# Altium schematic sheet main_Sheet1.SchDoc
size 594 x 420 mm; SheetNumber: 1; SheetTotal: 1; ListNumber: 1; Обозначение: ИУ4.11.03.03.25.08.05.1 Э3; Наименование1: Автоматизированный; Наименование2: подводный дрон; Тип документа: Схема электрическая принципиальная
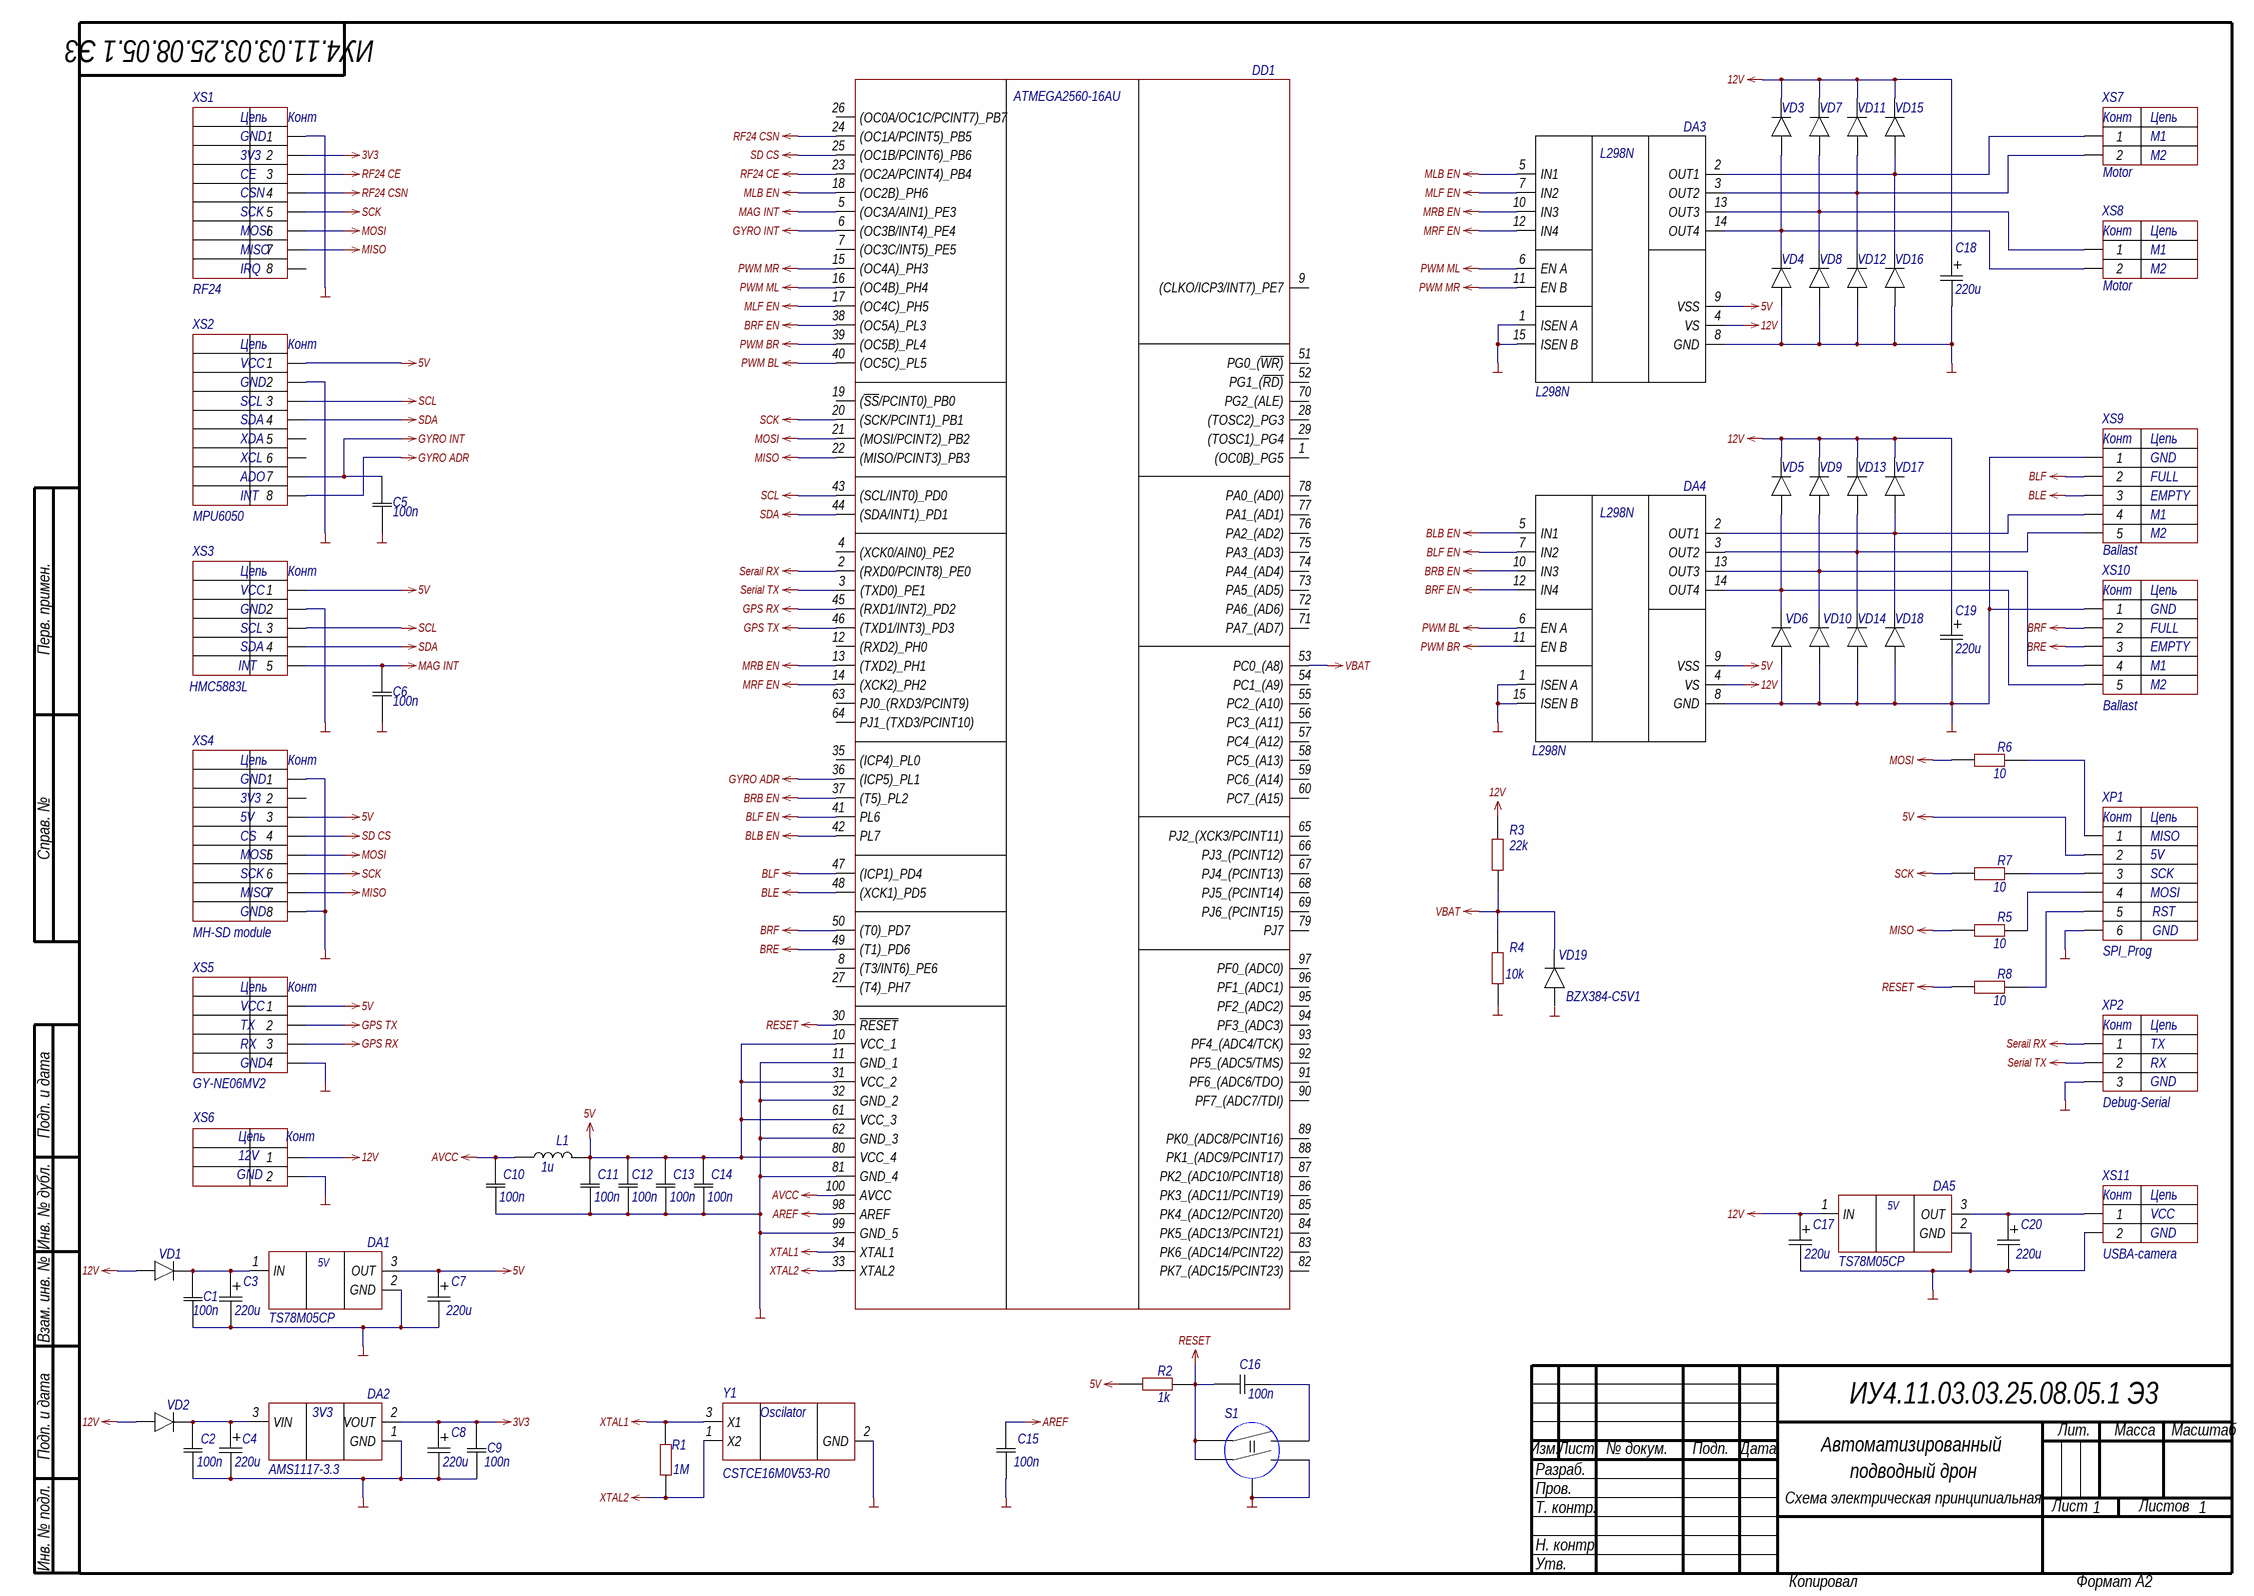
[diagram p0: main_Sheet1.SchDoc]

## Parts
C1  100n  [CAPC3216X95N]
C2  100n  [CAPC3216X95N]
C3  220u  [CAPAE830X1050N]
C4  220u  [CAPAE830X1050N]
C5  100n  [CAPC3216X95N]
C6  100n  [CAPC3216X95N]
C7  220u  [CAPAE830X1050N]
C8  220u  [CAPAE830X1050N]
C9  100n  [CAPC3216X95N]
C10  100n  [CAPC3216X95N]
C11  100n  [CAPC3216X95N]
C12  100n  [CAPC3216X95N]
C13  100n  [CAPC3216X95N]
C14  100n  [CAPC3216X95N]
C15  100n  [CAPC3216X95N]
C16  100n  [CAPC3216X95N]
C17  220u  [CAPAE830X1050N]
C18  220u  [CAPAE830X1050N]
C19  220u  [CAPAE830X1050N]
C20  220u  [CAPAE830X1050N]
DA1  TS78M05CP  [TS78M05CP]
DA2  AMS1117-3.3  [SOT229P700X180-4N]
DA3  L298N  [TO127P500X2020X2210-15P]
DA4  L298N  [TO127P500X2020X2210-15P]
DA5  TS78M05CP  [TS78M05CP]
DD1  ATMEGA2560-16AU  [QFP50P1600X1600X120-100N]  (value not drawn)
L1  1u  [INDPM3225X240N]
R1  1M  [RESC3126X65N]
R2  1k  [RESC3126X65N]
R3  22k  [RESC3126X65N]
R4  10k  [RESC3126X65N]
R5  10  [RESC3126X65N]
R6  10  [RESC3126X65N]
R7  10  [RESC3126X65N]
R8  10  [RESC3126X65N]
S1  FSM1LPASTR  [FSM1LPASTR]  (value not drawn)
VD1  (no value)  [1N4007W]
VD2  1N4007W  [1N4007W]  (value not drawn)
VD3  1N4007W  [1N4007W]  (value not drawn)
VD4  1N4007W  [1N4007W]  (value not drawn)
VD5  1N4007W  [1N4007W]  (value not drawn)
VD6  1N4007W  [1N4007W]  (value not drawn)
VD7  1N4007W  [1N4007W]  (value not drawn)
VD8  1N4007W  [1N4007W]  (value not drawn)
VD9  1N4007W  [1N4007W]  (value not drawn)
VD10  1N4007W  [1N4007W]  (value not drawn)
VD11  1N4007W  [1N4007W]  (value not drawn)
VD12  1N4007W  [1N4007W]  (value not drawn)
VD13  1N4007W  [1N4007W]  (value not drawn)
VD14  1N4007W  [1N4007W]  (value not drawn)
VD15  1N4007W  [1N4007W]  (value not drawn)
VD16  1N4007W  [1N4007W]  (value not drawn)
VD17  1N4007W  [1N4007W]  (value not drawn)
VD18  1N4007W  [1N4007W]  (value not drawn)
VD19  BZX384-C5V1  [SOD2512X110N]
XP1  SPI_Prog  [PLS_2x3]
XP2  Debug-Serial  [PLS_1x3]
XS1  RF24  [nRF24]
XS2  MPU6050  [MPU6050]
XS3  HMC5883L  [HMC5883L]
XS4  MH-SD module  [SD-module]
XS5  GY-NE06MV2  [GY-GPS]
XS6  XT60PW-M  [XT60PWM]  (value not drawn)
XS7  Motor  [S2B-XH-A-1]
XS8  Motor  [S2B-XH-A-1]
XS9  Ballast  [S5B-XH-A-1]
XS10  Ballast  [S5B-XH-A-1]
XS11  USBA-camera  [TYPE-C-SMD]
Y1  CSTCE16M0V53-R0  [CSTCE16M0V53R0]

## Nets
3V3: C8.1(+) C9.1 DA2.2(VOUT) XS1.2
5V: C7.1(+) C11.1 C12.1 C13.1 C14.1 DA1.3(OUT) DA3.9(VSS) DA4.9(VSS) DD1.10(VCC_1) DD1.31(VCC_2) DD1.61(VCC_3) DD1.80(VCC_4) L1.2 R2.1 XP1.2 XS2.1 XS3.1 XS4.3 XS5.1
12V: C17.1(+) C18.1(+) C19.1(+) DA3.4(VS) DA4.4(VS) DA5.1(IN) R3.2 VD1.2(A) VD2.2(A) VD3.1(K) VD5.1(K) VD7.1(K) VD9.1(K) VD11.1(K) VD13.1(K) VD15.1(K) VD17.1(K) XS6.1
AREF: C15.1 DD1.98(AREF)
AVCC: C10.1 DD1.100(AVCC) L1.1
BLB EN: DA4.5(IN1) DD1.42(PL7)
BLE: DD1.48((XCK1)_PD5) XS9.3
BLF: DD1.47((ICP1)_PD4) XS9.2
BLF EN: DA4.7(IN2) DD1.41(PL6)
BRB EN: DA4.10(IN3) DD1.37((T5)_PL2)
BRE: DD1.49((T1)_PD6) XS10.3
BRF: DD1.50((T0)_PD7) XS10.2
BRF EN: DA4.12(IN4) DD1.38((OC5A)_PL3)
GND: C1.2 C2.2 C3.2(-) C4.2(-) C5.2 C6.2 C7.2(-) C8.2(-) C9.2 C10.2 C11.2 C12.2 C13.2 C14.2 C15.2 C17.2(-) C18.2(-) C19.2(-) C20.2(-) DA1.2(GND) DA2.1(GND) DA3.1(ISEN_A) DA3.8(GND) DA3.15(ISEN_B) DA4.1(ISEN_A) DA4.8(GND) DA4.15(ISEN_B) DA5.2(GND) DD1.11(GND_1) DD1.32(GND_2) DD1.62(GND_3) DD1.81(GND_4) DD1.99(GND_5) R4.1 S1.4(NO_2) S1.5(GND) VD4.2(A) VD6.2(A) VD8.2(A) VD10.2(A) VD12.2(A) VD14.2(A) VD16.2(A) VD18.2(A) XP1.6 XP2.3 XS1.1 XS2.2 XS3.2 XS4.1 XS4.8 XS5.4 XS6.2 XS9.1 XS10.1 XS11.4(2) Y1.2(GND)
GPS RX: DD1.45((RXD1/INT2)_PD2) XS5.3
GPS TX: DD1.46((TXD1/INT3)_PD3) XS5.2
GYRO ADR: DD1.36((ICP5)_PL1) XS2.8
GYRO INT: C5.1 DD1.6((OC3B/INT4)_PE4) XS2.7
MAG INT: C6.1 DD1.5((OC3A/AIN1)_PE3) XS3.5
MISO: DD1.22((MISO/PCINT3)_PB3) R5.1 XS1.7 XS4.7
MLB EN: DA3.5(IN1) DD1.18((OC2B)_PH6)
MLF EN: DA3.7(IN2) DD1.17((OC4C)_PH5)
MOSI: DD1.21((MOSI/PCINT2)_PB2) R6.1 XS1.6 XS4.5
MRB EN: DA3.10(IN3) DD1.13((TXD2)_PH1)
MRF EN: DA3.12(IN4) DD1.14((XCK2)_PH2)
PWM BL: DA4.6(EN_A) DD1.40((OC5C)_PL5)
PWM BR: DA4.11(EN_B) DD1.39((OC5B)_PL4)
PWM ML: DA3.6(EN_A) DD1.16((OC4B)_PH4)
PWM MR: DA3.11(EN_B) DD1.15((OC4A)_PH3)
RESET: C16.1 DD1.30(~{RESET}) R2.2 R8.1 S1.1(COM_1) S1.2(COM_2)
RF24 CE: DD1.23((OC2A/PCINT4)_PB4) XS1.3
RF24 CSN: DD1.24((OC1A/PCINT5)_PB5) XS1.4
SCK: DD1.20((SCK/PCINT1)_PB1) R7.1 XS1.5 XS4.6
SCL: DD1.43((SCL/INT0)_PD0) XS2.3 XS3.3
SD CS: DD1.25((OC1B/PCINT6)_PB6) XS4.4
SDA: DD1.44((SDA/INT1)_PD1) XS2.4 XS3.4
Serail RX: DD1.2((RXD0/PCINT8)_PE0) XP2.1
Serial TX: DD1.3((TXD0)_PE1) XP2.2
VBAT: DD1.53(PC0_(A8)) R3.1 R4.2 VD19.1(K)
XTAL1: DD1.34(XTAL1) R1.2 Y1.3(X1)
XTAL2: DD1.33(XTAL2) R1.1 Y1.1(X2)
NetC1_1: C1.1 C3.1(+) DA1.1(IN) VD1.1(K)
NetC2_1: C2.1 C4.1(+) DA2.3(VIN) VD2.1(K)
NetC16_2: C16.2 S1.3(NO_1)
NetC20_1: C20.1(+) DA5.3(OUT) XS11.1
NetDA3_2: DA3.2(OUT1) VD15.2(A) VD16.1(K) XS7.1
NetDA3_3: DA3.3(OUT2) VD11.2(A) VD12.1(K) XS7.2
NetDA3_13: DA3.13(OUT3) VD7.2(A) VD8.1(K) XS8.1
NetDA3_14: DA3.14(OUT4) VD3.2(A) VD4.1(K) XS8.2
NetDA4_2: DA4.2(OUT1) VD17.2(A) VD18.1(K) XS9.4
NetDA4_3: DA4.3(OUT2) VD13.2(A) VD14.1(K) XS9.5
NetDA4_13: DA4.13(OUT3) VD9.2(A) VD10.1(K) XS10.4
NetDA4_14: DA4.14(OUT4) VD5.2(A) VD6.1(K) XS10.5
NetR5_2: R5.2 XP1.4
NetR6_2: R6.2 XP1.1
NetR7_2: R7.2 XP1.3
NetR8_2: R8.2 XP1.5

Not connected (* = marked no-connect by the designer): DD1 1((OC0B)_PG5) 4((XCK0/AIN0)_PE2) 7((OC3C/INT5)_PE5) 8((T3/INT6)_PE6) 9((CLKO/ICP3/INT7)_PE7) 12((RXD2)_PH0) 19((~{SS}/PCINT0)_PB0) 26((OC0A/OC1C/PCINT7)_PB7) 27((T4)_PH7) 28((TOSC2)_PG3) 29((TOSC1)_PG4) 35((ICP4)_PL0) 51(PG0_(~{WR)}) 52(PG1_(~{RD)}) 54(PC1_(A9)) 55(PC2_(A10)) 56(PC3_(A11)) 57(PC4_(A12)) 58(PC5_(A13)) 59(PC6_(A14)) 60(PC7_(A15)) 63(PJ0_(RXD3/PCINT9)) 64(PJ1_(TXD3/PCINT10)) 65(PJ2_(XCK3/PCINT11)) 66(PJ3_(PCINT12)) 67(PJ4_(PCINT13)) 68(PJ5_(PCINT14)) 69(PJ6_(PCINT15)) 70(PG2_(ALE)) 71(PA7_(AD7)) 72(PA6_(AD6)) 73(PA5_(AD5)) 74(PA4_(AD4)) 75(PA3_(AD3)) 76(PA2_(AD2)) 77(PA1_(AD1)) 78(PA0_(AD0)) 79(PJ7) 82(PK7_(ADC15/PCINT23)) 83(PK6_(ADC14/PCINT22)) 84(PK5_(ADC13/PCINT21)) 85(PK4_(ADC12/PCINT20)) 86(PK3_(ADC11/PCINT19)) 87(PK2_(ADC10/PCINT18)) 88(PK1_(ADC9/PCINT17)) 89(PK0_(ADC8/PCINT16)) 90(PF7_(ADC7/TDI)) 91(PF6_(ADC6/TDO)) 92(PF5_(ADC5/TMS)) 93(PF4_(ADC4/TCK)) 94(PF3_(ADC3)) 95(PF2_(ADC2)) 96(PF1_(ADC1)) 97(PF0_(ADC0)); VD19 2(A); XS1 8; XS2 5 6; XS4 2

## Notes on the sheet
- Labels drawn without touching a wire or pin: GND
- Перв. примен.
- Справ. №
- Подп. и дата
- Инв. № дубл.
- Взам. инв. №
- Разраб.
- Изм.
- Лист
- № докум.
- Подп.
- Дата
- Лит.
- Масса
- Масштаб
- Пров.
- Т. контр.
- Листов
- Инв. № подл.
- Н. контр.
- Утв.
- Копировал
- Формат А2
- (in symbol AMS1117-3.3) 3V3
- (in symbol Ballast) Конт; Цепь; GND; FULL; EMPTY; M1; M2
- (in symbol CSTCE16M0V53-R0) Oscilator
- (in symbol Debug-Serial) Конт; Цепь; TX; RX; GND
- (in symbol GY-NE06MV2) Цепь; Конт; VCC; TX; RX; GND
- (in symbol HMC5883L) Цепь; Конт; VCC; GND; SCL; SDA; INT
- (in symbol MH-SD module) Цепь; Конт; GND; 3V3; 5V; CS; MOSI; SCK; MISO
- (in symbol Motor) Конт; Цепь; M1; M2
- (in symbol MPU6050) Цепь; Конт; VCC; GND; SCL; SDA; XDA; XCL; ADO; INT
- (in symbol nRF24) Цепь; Конт; GND; 3V3; CE; CSN; SCK; MOSI; MISO; IRQ
- (in symbol SPI_Prog) Конт; Цепь; MISO; 5V; SCK; MOSI; RST; GND
- (in symbol TS78M05CP) 5V
- (in symbol USBA-camera) Конт; Цепь; VCC; GND
- (in symbol XT60PW-M) Цепь; Конт; 12V; GND

## Library data of the parts
C1 C2 C5 C6 C9-C16 = GRM319R72A104KA01D: Capacitor; Manufacturer_Name: Murata Electronics; Datasheet Link: https://search.murata.co.jp/Ceramy/image/img/A01X/G101/ENG/GRM319R72A104KA01-01A.pdf; Height: 0.95mm; Manufacturer_Part_Number: GRM319R72A104KA01D; Mouser Part Number: 81-GRM319R72A104KA1D; Mouser Price/Stock: https://www.mouser.co.uk/ProductDetail/Murata-Electronics/GRM319R72A104KA01D?qs=aHh07ZX1ACw840PhdyBNvA%3D%3D; Arrow Part Number: GRM319R72A104KA01D; Arrow Price/Stock: https://www.arrow.com/en/products/grm319r72a104ka01d/murata-manufacturing?region=europe
C3 C4 C7 C8 C17-C20 = EMVY350ADA221MHA0G: Capacitor; Manufacturer_Name: Chemi-Con; Datasheet Link: https://componentsearchengine.com/Datasheets/1/EMVY350ADA221MHA0G.pdf; Height: 10.5mm; Manufacturer_Part_Number: EMVY350ADA221MHA0G; Mouser Part Number: 661-EMVY350ADA221MHA; Mouser Price/Stock: https://www.mouser.co.uk/ProductDetail/United-Chemi-Con/EMVY350ADA221MHA0G?qs=75gN6mbWSpp8aC7huPmjnA%3D%3D
DA1 DA5 = TS78M05CP: Integrated Circuit; Manufacturer_Name: Taiwan Semiconductor; Datasheet Link: https://componentsearchengine.com/Datasheets/1/TS78M05CP.pdf; Height: 2.38mm; Manufacturer_Part_Number: TS78M05CP; Mouser Part Number: 821-TS78M05CP; Mouser Price/Stock: https://www.mouser.co.uk/ProductDetail/Taiwan-Semiconductor/TS78M05CP?qs=F0bBuU9YDEzJZsmmDzcbEA%3D%3D
DA2 = AMS1117-3.3: Integrated Circuit; Manufacturer_Name: Advanced; Datasheet Link: https://datasheet.datasheetarchive.com/originals/distributors/Datasheets-28/DSA-550594.pdf; Height: 1.8mm; Manufacturer_Part_Number: AMS1117-3.3
DA3 DA4 = L298N: Integrated Circuit; Manufacturer_Name: STMicroelectronics; Datasheet Link: http://www.st.com/web/en/resource/technical/document/datasheet/CD00000240.pdf; Height: 5mm; Manufacturer_Part_Number: L298N; Mouser Part Number: 511-L298; Mouser Price/Stock: https://www.mouser.co.uk/ProductDetail/STMicroelectronics/L298N?qs=gr8Zi5OG3Mj6jDtNclcF9Q%3D%3D; Arrow Part Number: L298N; Arrow Price/Stock: https://www.arrow.com/en/products/l298n/stmicroelectronics?region=europe
DD1 = ATMEGA2560-16AU: Integrated Circuit; Manufacturer_Name: Microchip; Datasheet Link: https://datasheet.datasheetarchive.com/originals/distributors/Datasheets_SAMA/4a5a397fa76c39b5297f4121ace1d84e.pdf; Height: 1.2mm; Manufacturer_Part_Number: ATMEGA2560-16AU; Mouser Part Number: 556-ATMEGA2560-16AU; Mouser Price/Stock: https://www.mouser.co.uk/ProductDetail/Microchip-Technology/ATMEGA2560-16AU?qs=aqrrBurbvGciYmlAokFS0w%3D%3D; Arrow Part Number: ATMEGA2560-16AU; Arrow Price/Stock: null?region=nac
L1 = NLCV32T-1R0M-EF: Inductor; Manufacturer_Name: TDK; Datasheet Link: https://product.tdk.com/system/files/dam/doc/product/inductor/inductor/smd/catalog/inductor_commercial_decoupling_nlcv32-ef_en.pdf; Height: 2.4mm; Manufacturer_Part_Number: NLCV32T-1R0M-EF; Mouser Part Number: 810-NLCV32T-1R0M-EF; Mouser Price/Stock: https://www.mouser.co.uk/ProductDetail/TDK/NLCV32T-1R0M-EF?qs=0rbOLB9uh%252BCtPRP0lL0opQ%3D%3D; Arrow Part Number: NLCV32T-1R0M-EF; Arrow Price/Stock: https://www.arrow.com/en/products/nlcv32t-1r0m-ef/tdk
R1 = 1M: Resistor; Manufacturer_Name: Multicomp Pro; Manufacturer_Part_Number: MP000277; Datasheet Link: http://www.farnell.com/datasheets/2818227.pdf?_ga=2.267231047.871788558.1580380855-2055961957.1580380855&_gac=1.245689776.1580380855.EAIaIQobChMI-IPluZGr5wIVSbTtCh2dnAIbEAAYASAAEgItj_D_BwE; Height: 0.65mm
R2 = 1k: Resistor; Manufacturer_Name: Multicomp Pro; Manufacturer_Part_Number: MP000277; Datasheet Link: http://www.farnell.com/datasheets/2818227.pdf?_ga=2.267231047.871788558.1580380855-2055961957.1580380855&_gac=1.245689776.1580380855.EAIaIQobChMI-IPluZGr5wIVSbTtCh2dnAIbEAAYASAAEgItj_D_BwE; Height: 0.65mm
R3 = 10k: Resistor; Manufacturer_Name: Multicomp Pro; Manufacturer_Part_Number: MP000277; Datasheet Link: http://www.farnell.com/datasheets/2818227.pdf?_ga=2.267231047.871788558.1580380855-2055961957.1580380855&_gac=1.245689776.1580380855.EAIaIQobChMI-IPluZGr5wIVSbTtCh2dnAIbEAAYASAAEgItj_D_BwE; Height: 0.65mm
R4 = 22k: Resistor; Manufacturer_Name: Multicomp Pro; Manufacturer_Part_Number: MP000277; Datasheet Link: http://www.farnell.com/datasheets/2818227.pdf?_ga=2.267231047.871788558.1580380855-2055961957.1580380855&_gac=1.245689776.1580380855.EAIaIQobChMI-IPluZGr5wIVSbTtCh2dnAIbEAAYASAAEgItj_D_BwE; Height: 0.65mm
R5-R8 = 10: Resistor; Manufacturer_Name: Multicomp Pro; Manufacturer_Part_Number: MP000277; Datasheet Link: http://www.farnell.com/datasheets/2818227.pdf?_ga=2.267231047.871788558.1580380855-2055961957.1580380855&_gac=1.245689776.1580380855.EAIaIQobChMI-IPluZGr5wIVSbTtCh2dnAIbEAAYASAAEgItj_D_BwE; Height: 0.65mm
S1 = FSM1LPASTR: Switch; Manufacturer_Name: TE Connectivity; Datasheet Link: https://www.mouser.in/datasheet/2/418/8/ENG_CD_1977263_A4-2580310.pdf; Height: 3.4mm; Manufacturer_Part_Number: FSM1LPASTR; Mouser Part Number: 506-FSM1LPASTR; Mouser Price/Stock: https://www.mouser.co.uk/ProductDetail/TE-Connectivity-Alcoswitch/FSM1LPASTR?qs=Of7OaoM7rsHQhVPJYy1acQ%3D%3D
VD1-VD18 = 1N4007W: Diode; Manufacturer_Name: Jingdao Microelectronics; Datasheet Link: https://datasheet.lcsc.com/szlcsc/Shandong-Jingdao-Microelectronics-1N4007W_C108803.pdf; Height: 1.1mm; Manufacturer_Part_Number: 1N4007W
VD19 = BZX384-C5V1: Diode; Manufacturer_Name: Nexperia; Datasheet Link: https://datasheet.datasheetarchive.com/originals/distributors/Datasheets-20/DSA-380037.pdf; Height: 1.1mm; Manufacturer_Part_Number: BZX384-C5V1; Mouser Part Number: N/A; Mouser Price/Stock: https://www.mouser.co.uk/ProductDetail/Nexperia/BZX384-C5V1?qs=vHuUswq2%252Bszm012Dq%252BI0lA%3D%3D
XP1 = SPI_Prog: Connector
XP2 = Debug-Serial: Connector
XS1 = nRF24: Connector
XS2 = MPU6050: Connector
XS3 = HMC5883L: Connector
XS4 = MH-SD module: Connector
XS5 = GY-NE06MV2: Connector
XS6 = XT60PW-M: Connector; Manufacturer_Name: Changzou Amass Elec; Datasheet Link: https://www.tme.eu/Document/9b8d0c5eb7094295f3d3112c214d3ade/XT60PW%20SPEC.pdf; Height: 8.4mm; Manufacturer_Part_Number: XT60PW-M
XS7 XS8 = Motor: Connector
XS9 XS10 = Ballast: Connector
XS11 = USBA-camera: Connector
Y1 = CSTCE16M0V53-R0: Oscillator; Manufacturer_Name: Murata Electronics; Datasheet Link: https://www.murata.com/en-sg/products/productdetail?partno=CSTCE16M0V53-R0; Height: 1mm; Manufacturer_Part_Number: CSTCE16M0V53-R0; Mouser Part Number: 81-CSTCE16M0V53-R0; Mouser Price/Stock: https://www.mouser.co.uk/ProductDetail/Murata-Electronics/CSTCE16M0V53-R0?qs=HPA2Xx%252BU0WhPWbRcNuzhZw%3D%3D